# Altium schematic sheet RPI GPIO BOARD.SchDoc
size B; SheetNumber: 1; SheetTotal: 1
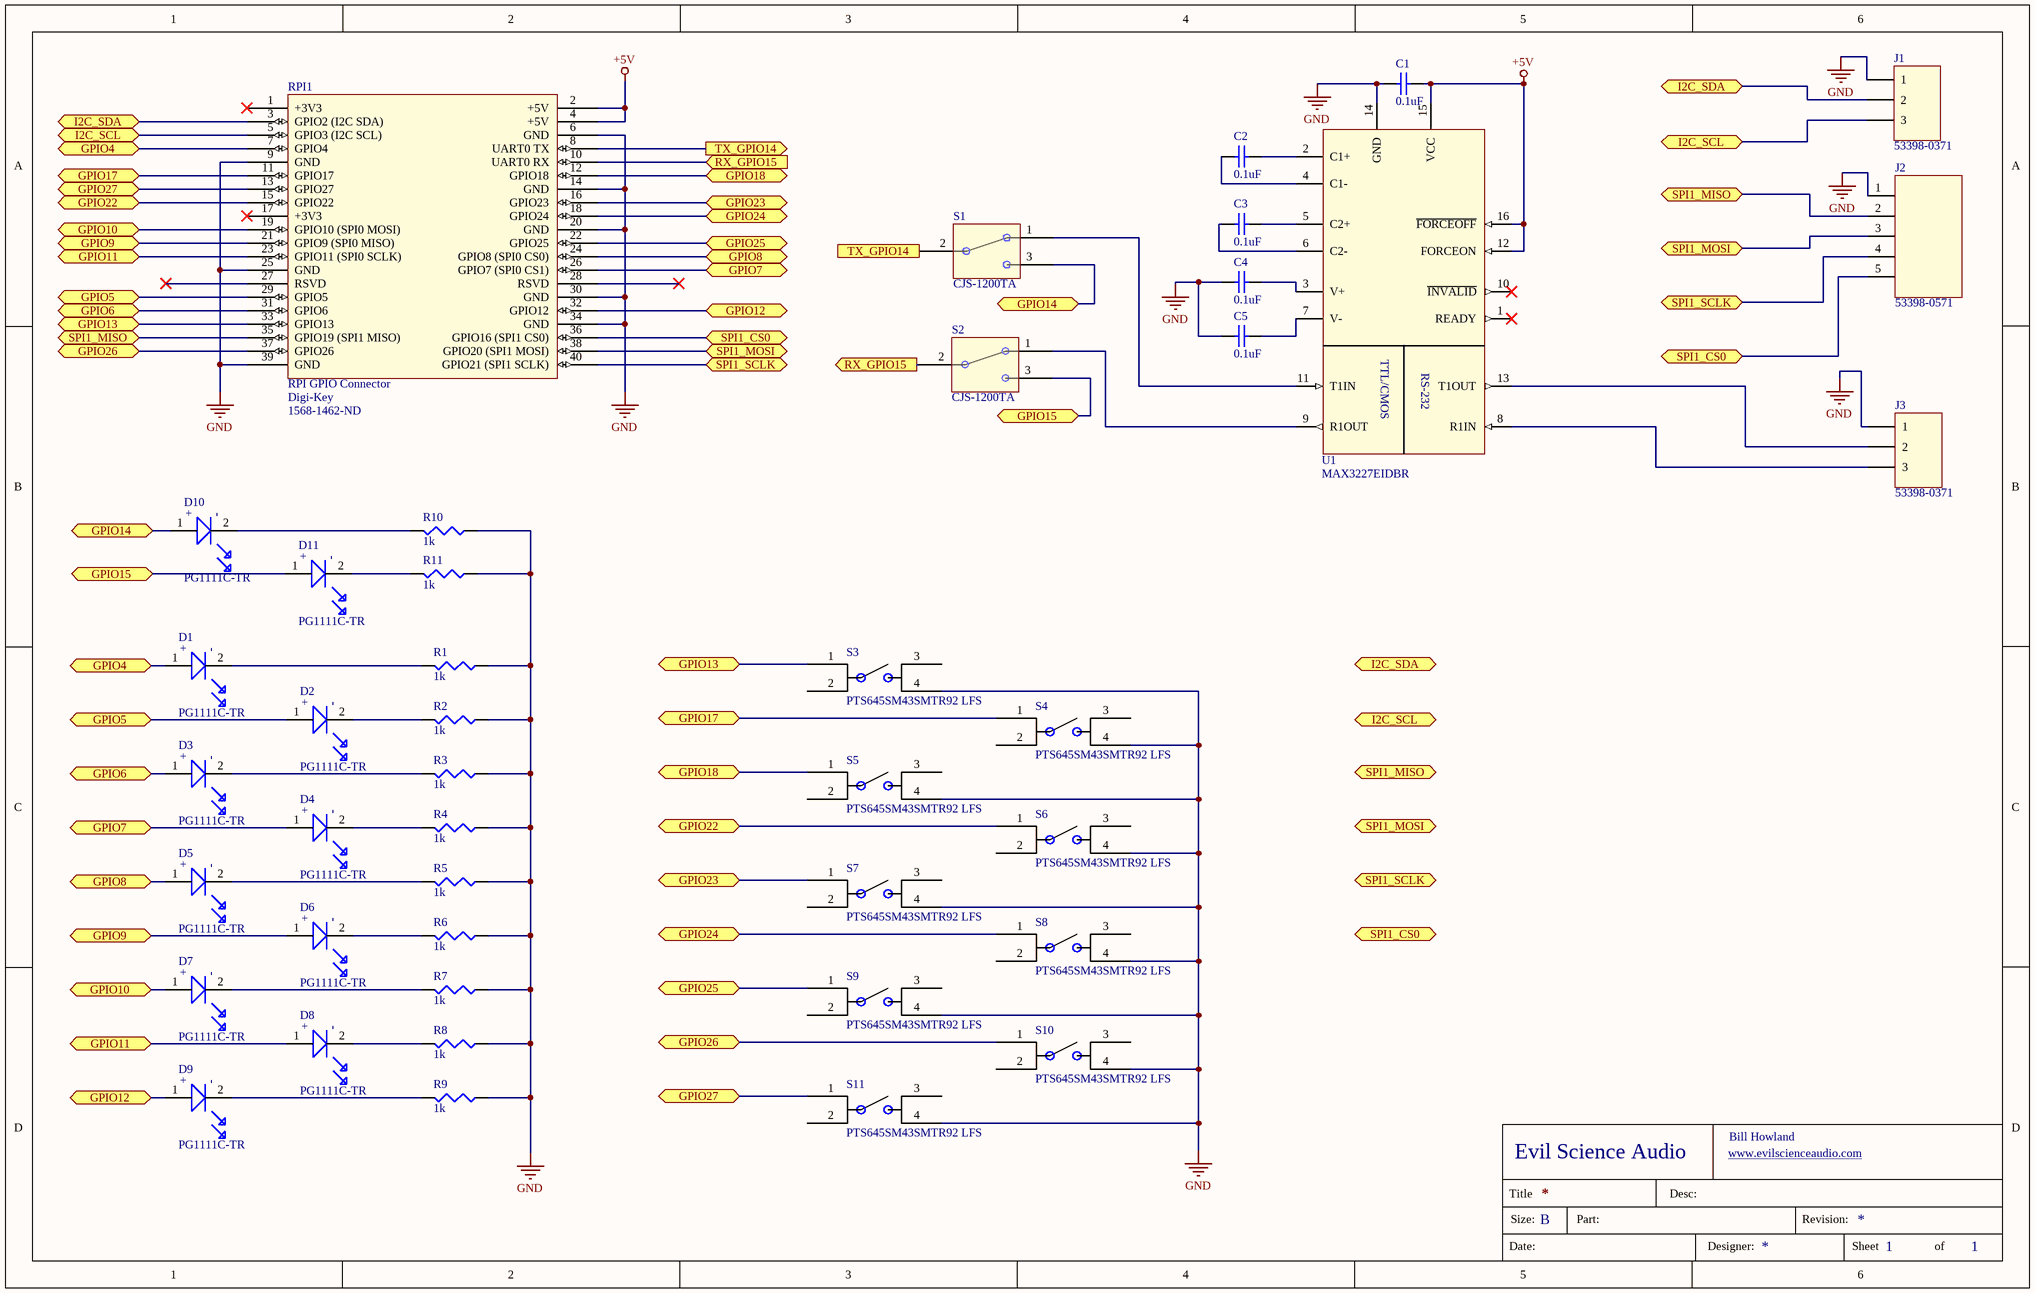
[diagram p0: RPI GPIO BOARD.SchDoc]

## Parts
C1  0.1uF  [CAP_0603_MED]
C2  0.1uF  [CAP_0603_MED]
C3  0.1uF  [CAP_0603_MED]
C4  0.1uF  [CAP_0603_MED]
C5  0.1uF  [CAP_0603_MED]
D1  PG1111C-TR  [PG1111C-TR]
D2  PG1111C-TR  [PG1111C-TR]
D3  PG1111C-TR  [PG1111C-TR]
D4  PG1111C-TR  [PG1111C-TR]
D5  PG1111C-TR  [PG1111C-TR]
D6  PG1111C-TR  [PG1111C-TR]
D7  PG1111C-TR  [PG1111C-TR]
D8  PG1111C-TR  [PG1111C-TR]
D9  PG1111C-TR  [PG1111C-TR]
D10  PG1111C-TR  [PG1111C-TR]
D11  PG1111C-TR  [PG1111C-TR]
J1  53398-0371  [53398-0371]
J2  53398-0571  [53398-0571]
J3  53398-0371  [53398-0371]
R1  1k  [RES_0603_MED]
R2  1k  [RES_0603_MED]
R3  1k  [RES_0603_MED]
R4  1k  [RES_0603_MED]
R5  1k  [RES_0603_MED]
R6  1k  [RES_0603_MED]
R7  1k  [RES_0603_MED]
R8  1k  [RES_0603_MED]
R9  1k  [RES_0603_MED]
R10  1k  [RES_0603_MED]
R11  1k  [RES_0603_MED]
RPI1  RPI GPIO Connector  Supplier 1: Digi-Key  Supplier Part Number 1: 1568-1462-ND  [rpi]
S1  CJS-1200TA  [CJS-1200TA]
S2  CJS-1200TA  [CJS-1200TA]
S3  PTS645SM43SMTR92 LFS  [PTS645SM43SMTR92 LFS]
S4  PTS645SM43SMTR92 LFS  [PTS645SM43SMTR92 LFS]
S5  PTS645SM43SMTR92 LFS  [PTS645SM43SMTR92 LFS]
S6  PTS645SM43SMTR92 LFS  [PTS645SM43SMTR92 LFS]
S7  PTS645SM43SMTR92 LFS  [PTS645SM43SMTR92 LFS]
S8  PTS645SM43SMTR92 LFS  [PTS645SM43SMTR92 LFS]
S9  PTS645SM43SMTR92 LFS  [PTS645SM43SMTR92 LFS]
S10  PTS645SM43SMTR92 LFS  [PTS645SM43SMTR92 LFS]
S11  PTS645SM43SMTR92 LFS  [PTS645SM43SMTR92 LFS]
U1  MAX3227EIDBR  [SSOP-DB-16 (MAX3227-EIDB)]

## Ports
GPIO4 (bidir), GPIO5 (bidir), GPIO6 (bidir), GPIO7 (bidir), GPIO8 (bidir), GPIO9 (bidir), GPIO10 (bidir), GPIO11 (bidir), GPIO12 (bidir), GPIO13 (bidir), GPIO14 (bidir), GPIO15 (bidir), GPIO17 (bidir), GPIO18 (bidir), GPIO22 (bidir), GPIO23 (bidir), GPIO24 (bidir), GPIO25 (bidir), GPIO26 (bidir), GPIO27 (bidir), I2C_SCL (bidir), I2C_SDA (bidir), RX_GPIO15 (in), RX_GPIO15 (out), SPI1_CS0 (bidir), SPI1_MISO (bidir), SPI1_MOSI (bidir), SPI1_SCLK (bidir), TX_GPIO14 (in), TX_GPIO14 (out)

## Nets
+5V: C1.2 RPI1.2(+5V) RPI1.4(+5V) U1.12(FORCEON) U1.15(VCC) U1.16(~{FORCEOFF})
GND: C1.1 C4.1 C5.1 J1.1 J2.1 J3.1 R1.1 R2.1 R3.1 R4.1 R5.1 R6.1 R7.1 R8.1 R9.1 R10.1 R11.1 RPI1.6(GND) RPI1.9(GND) RPI1.14(GND) RPI1.20(GND) RPI1.25(GND) RPI1.30(GND) RPI1.34(GND) RPI1.39(GND) S3.4 S4.4 S5.4 S6.4 S7.4 S8.4 S9.4 S10.4 S11.4 U1.14(GND)
GPIO4: D1.1(+) RPI1.7(GPIO4) ; port GPIO4
GPIO5: D2.1(+) RPI1.29(GPIO5) ; port GPIO5
GPIO6: D3.1(+) RPI1.31(GPIO6) ; port GPIO6
GPIO7: D4.1(+) RPI1.26(GPIO7_(SPI0_CS1)) ; port GPIO7
GPIO8: D5.1(+) RPI1.24(GPIO8_(SPI0_CS0)) ; port GPIO8
GPIO9: D6.1(+) RPI1.21(GPIO9_(SPI0_MISO)) ; port GPIO9
GPIO10: D7.1(+) RPI1.19(GPIO10_(SPI0_MOSI)) ; port GPIO10
GPIO11: D8.1(+) RPI1.23(GPIO11_(SPI0_SCLK)) ; port GPIO11
GPIO12: D9.1(+) RPI1.32(GPIO12) ; port GPIO12
GPIO13: RPI1.33(GPIO13) S3.1 ; port GPIO13
GPIO14: D10.1(+) S1.3 ; port GPIO14
GPIO15: D11.1(+) S2.3 ; port GPIO15
GPIO17: RPI1.11(GPIO17) S4.1 ; port GPIO17
GPIO18: RPI1.12(GPIO18) S5.1 ; port GPIO18
GPIO22: RPI1.15(GPIO22) S6.1 ; port GPIO22
GPIO23: RPI1.16(GPIO23) S7.1 ; port GPIO23
GPIO24: RPI1.18(GPIO24) S8.1 ; port GPIO24
GPIO25: RPI1.22(GPIO25) S9.1 ; port GPIO25
GPIO26: RPI1.37(GPIO26) S10.1 ; port GPIO26
GPIO27: RPI1.13(GPIO27) S11.1 ; port GPIO27
I2C_SCL: J1.3 RPI1.5(GPIO3_(I2C_SCL)) ; port I2C_SCL
I2C_SDA: J1.2 RPI1.3(GPIO2_(I2C_SDA)) ; port I2C_SDA
RX_GPIO15: RPI1.10(UART0_RX) S2.2 ; port RX_GPIO15
SPI1_CS0: J2.5 RPI1.36(GPIO16_(SPI1_CS0)) ; port SPI1_CS0
SPI1_MISO: J2.2 RPI1.35(GPIO19_(SPI1_MISO)) ; port SPI1_MISO
SPI1_MOSI: J2.3 RPI1.38(GPIO20_(SPI1_MOSI)) ; port SPI1_MOSI
SPI1_SCLK: J2.4 RPI1.40(GPIO21_(SPI1_SCLK)) ; port SPI1_SCLK
TX_GPIO14: RPI1.8(UART0_TX) S1.2 ; port TX_GPIO14
NetC2_1: C2.1 U1.2(C1+)
NetC2_2: C2.2 U1.4(C1-)
NetC3_1: C3.1 U1.6(C2-)
NetC3_2: C3.2 U1.5(C2+)
NetC4_2: C4.2 U1.3(V+)
NetC5_2: C5.2 U1.7(V-)
NetD1_2: D1.2(-) R1.2
NetD2_2: D2.2(-) R2.2
NetD3_2: D3.2(-) R3.2
NetD4_2: D4.2(-) R4.2
NetD5_2: D5.2(-) R5.2
NetD6_2: D6.2(-) R6.2
NetD7_2: D7.2(-) R7.2
NetD8_2: D8.2(-) R8.2
NetD9_2: D9.2(-) R9.2
NetD10_2: D10.2(-) R10.2
NetD11_2: D11.2(-) R11.2
NetJ3_2: J3.2 U1.13(T1OUT)
NetJ3_3: J3.3 U1.8(R1IN)
NetS1_1: S1.1 U1.11(T1IN)
NetS2_1: S2.1 U1.9(R1OUT)

Not connected (* = marked no-connect by the designer): RPI1 1(+3V3)* 17(+3V3)* 27(RSVD)* 28(RSVD)*; S3 2 3; S4 2 3; S5 2 3; S6 2 3; S7 2 3; S8 2 3; S9 2 3; S10 2 3; S11 2 3; U1 1(READY)* 10(~{INVALID})*

## Notes on the sheet
- Evil Science Audio
- www.evilscienceaudio.com <http://www.evilscienceaudio.com>
- Bill Howland
- Title
- Size:
- B
- Part:
- Desc:
- Revision:
- Date:
- Designer:
- Sheet
- of
- (in symbol CMP-00270-A.3) TTL/CMOS; RS-232

## Library data of the parts
C1-C5 = CMP-00495-A.6: CAP CER 0.1UF 25V 10% X7R 0603; MfgPartNo: GRM188R71E104KA01D; SLA Part No: SL00285; Mfg: Murata; Type: Ceramic - X7R; Capacitance: 0.1uF; Package: 603
D1-D11 = CMP-00197-A.4: LED GREEN DIFF 0603 SMD PG1111C-TR; SLA Part No: SL00017; Mfg: Stanley Electric Co; HelpURL: http://www.stanley-components.com/en/search/pdf_download.cfm?pdf_file=1111c_e.pdf; MfgPartNo: PG1111C-TR; Package: SMD
J1 J3 = CMP-00165-A.5: 53398-0371 PICOBLADE HEADER 3POS 1.25MM VERT SMD; SLA Part No: SL00482; Mfg: Molex; Gender: Male; MfgPartNo: 53398-0371; HelpURL: http://www.molex.com/pdm_docs/sd/533980471_sd.pdf; Mounting: Thru-Hole
J2 = CMP-00170-A.4: 53398-0571 PICOBLADE HEADER 5POS 1.25MM VERT SMD; SLA Part No: SL00454; Gender: Male; Mfg: Molex; HelpURL: http://www.molex.com/molex/products/datasheet.jsp?part=active/0533980571_PCB_HEADERS.xml; MfgPartNo: 53398-0571; Mounting: SMT
R1-R11 = CMP-00377-A.7: RES SMD 1K OHM 1% 1/10W 0603; MfgPartNo: ERJ-3EKF1001V; SLA Part No: SL00575; Mfg: Panasonic; Package: 603; Resistance: 1k
RPI1 = rpi connector: GPIO Header for Raspberry Pi A+/B+/Pi 2/Pi 3 - 2x20; Manufacturer: SparkFun Electronics; Manufacturer Part Number: PRT-14017; Nils Minor: author; nilsminor@web.de: mail; RoHS: RoHS Compliant; Category: Development Boards, Kits, Programmers; Stock 1: 150; Pricing 1: 1=1.84 (EUR); Part Status: Active; Accessory Type: Connector; For Use With/Related Products: Raspberry Pi; ComponentLink1URL: https://cdn.sparkfun.com/datasheets/Dev/RaspberryPi/12313.pdf; ComponentLink1Description: https://cdn.sparkfun.com/datasheets/Dev/RaspberryPi/12313.pdf
S1 S2 = CMP-00549-A.2: CJS-1200TA SWITCH SPDT DIP 1-POS 100mA 6VDC; Mfg: Copal; MfgPartNo: CJS-1200TA; Package: SMT; HelpURL: http://www.nidec-copal-electronics.com/e/catalog/switch/cjs.pdf
S3-S11 = CMP-00660-2: PTS645SM43SMTR92 LFS SWITCH TACTILE SPST-NO 0.05A 12V; Mfg: C&K; HelpURL: https://www.digikey.com/product-detail/en/c-k/PTS645SM43SMTR92-LFS/CKN9112CT-ND/1146934; Package: SMT; MfgPartNo: PTS645SM43SMTR92 LFS
U1 = CMP-00270-A.3: RS232, MAX3227EIDBR IC 3V-5.5V DRVR 16-SSOP; SLA Part No: SL00301; Mfg: Texas Instruments; HelpURL: http://www.ti.com/lit/ds/symlink/max3227e.pdf; MfgPartNo: MAX3227EIDBR; Package: 16-SSOP